# EasyEDA Pro project 3-PCB设计-勿外传.epro

# Schematic SCH1
Create Date: 2025-03-10; Page Name: P1; Project Name: AI虚拟女友; Schematic Name: SCH1; Update Date: 2025-03-10; Company: 嘉立创EDA; Page Size: A4; Version: V1.0
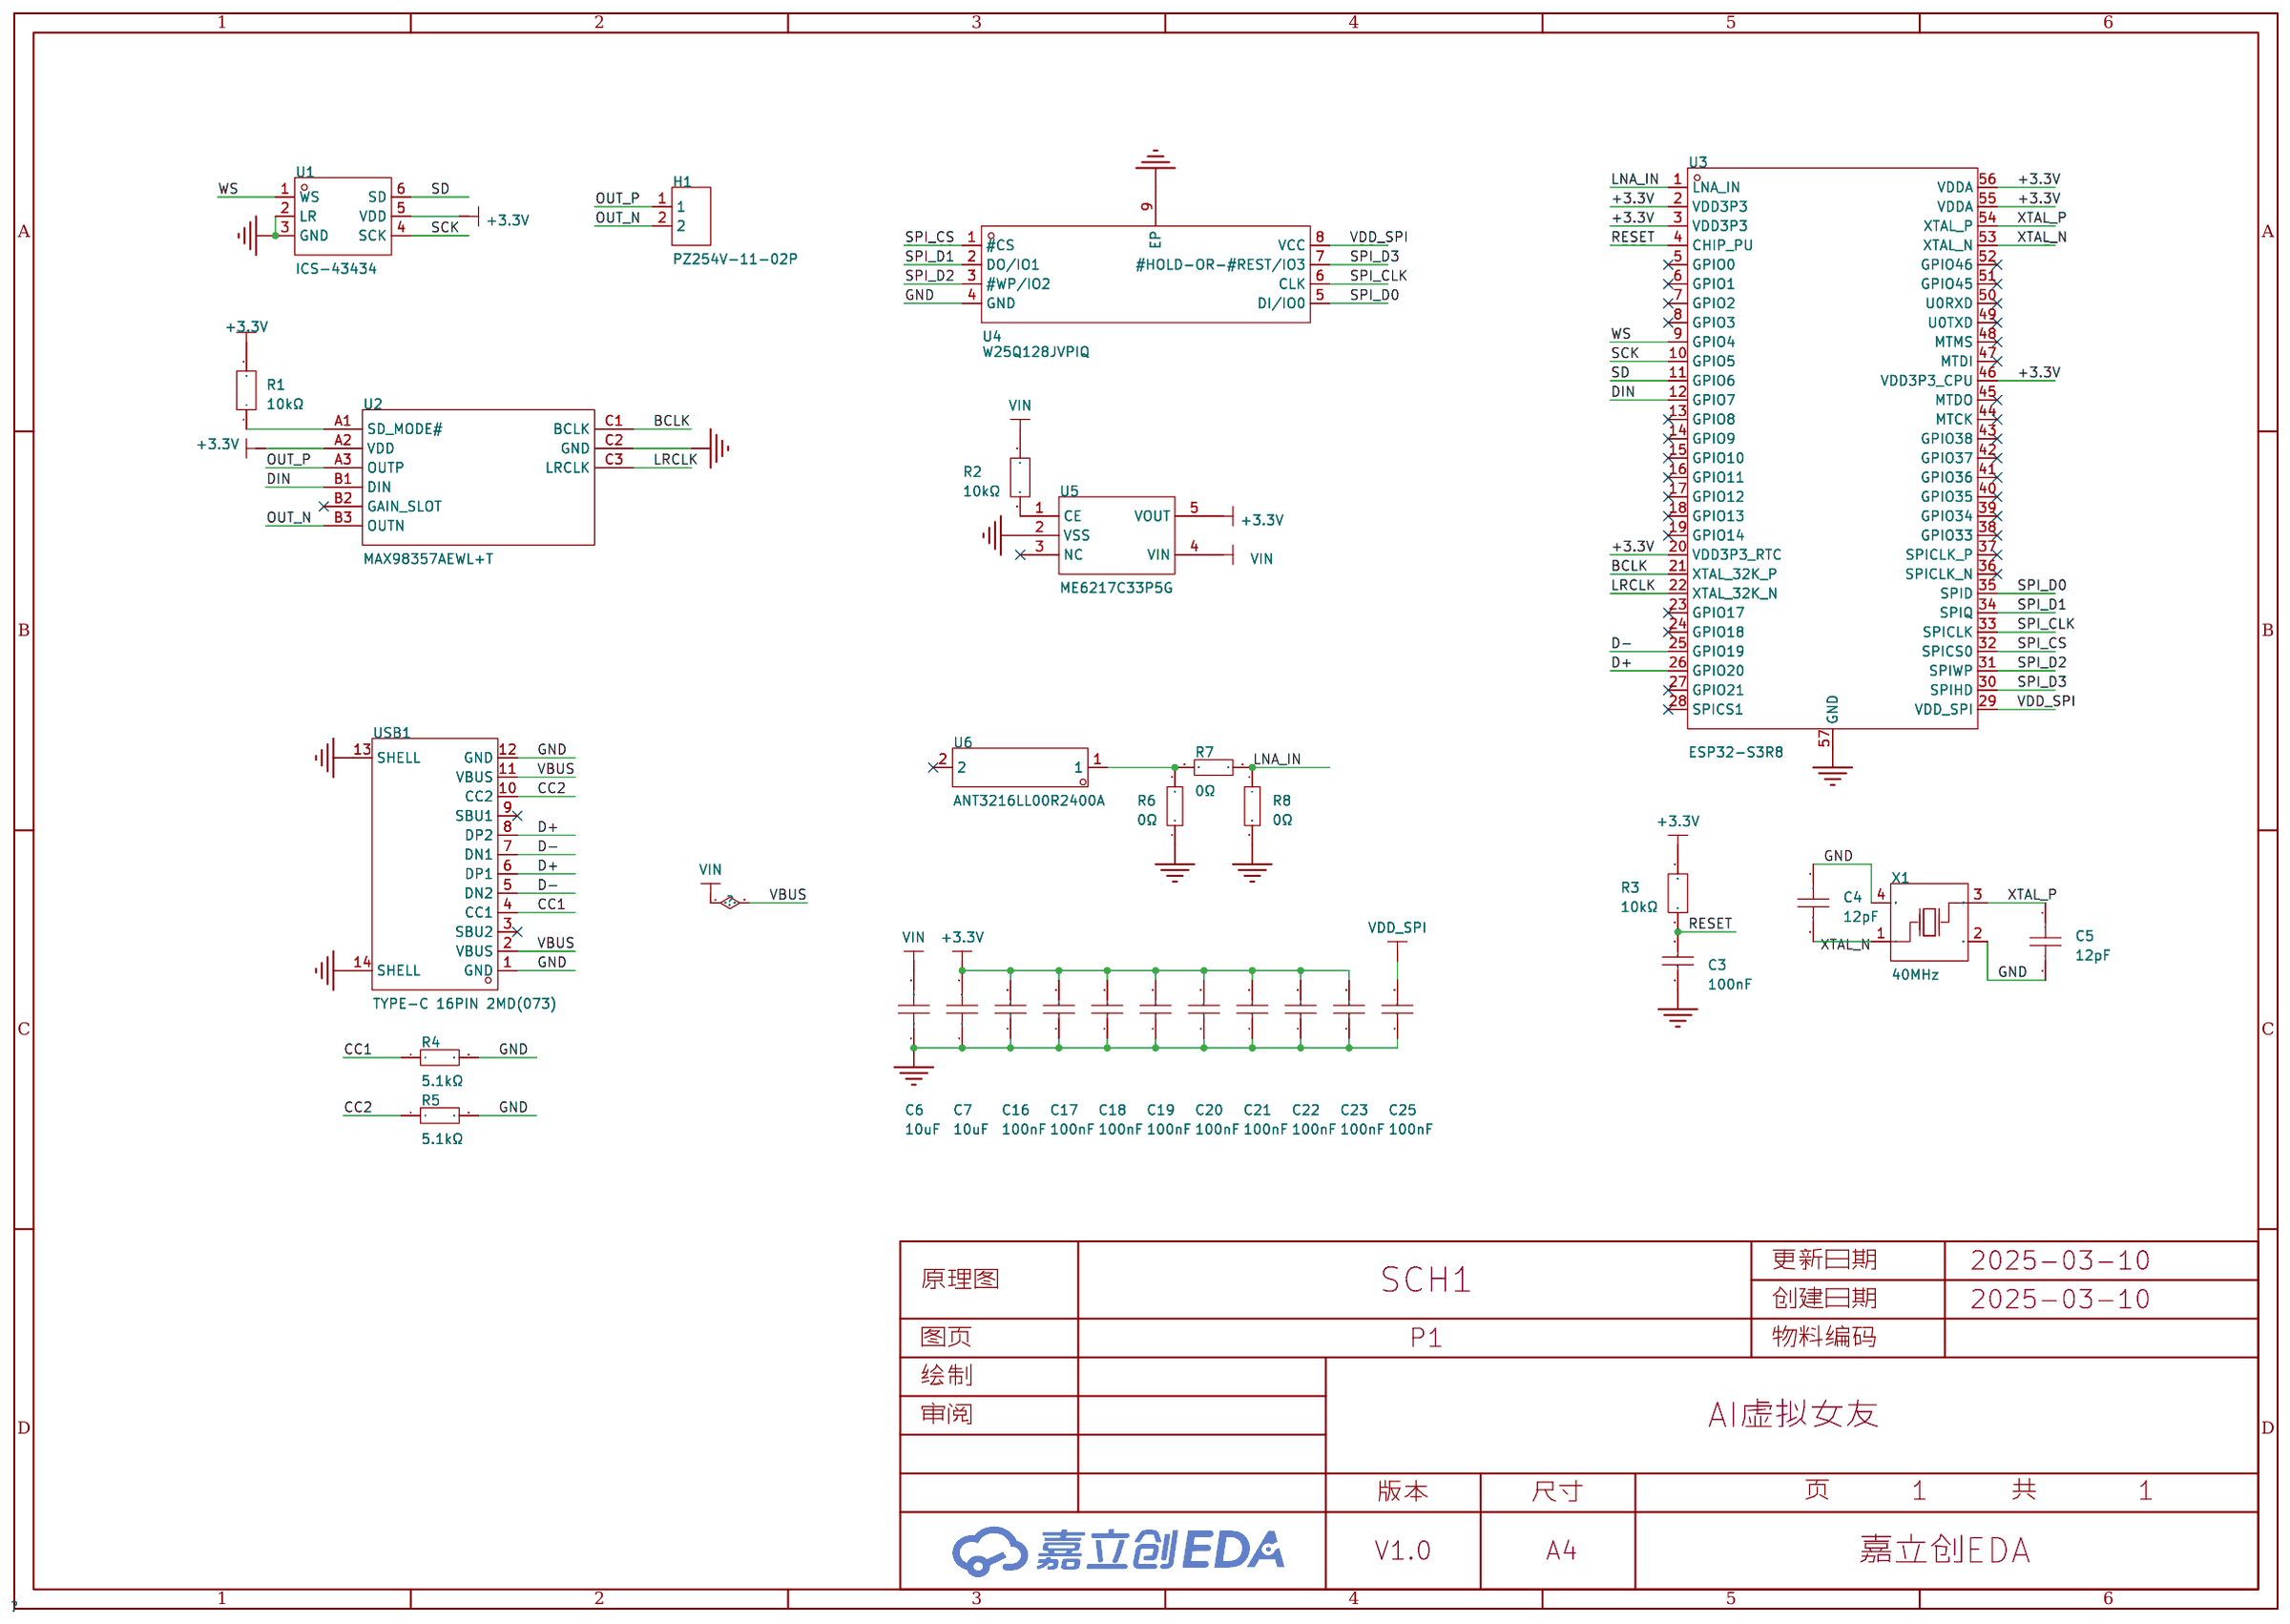
[diagram p0: schematic sheet]

## Parts
C3  100nF  [C0201]
C4  12pF  [C0201]
C5  12pF  [C0201]
C6  10uF  [C0603]
C7  10uF  [C0603]
C16  100nF  [C0201]
C17  100nF  [C0201]
C18  100nF  [C0201]
C19  100nF  [C0201]
C20  100nF  [C0201]
C21  100nF  [C0201]
C22  100nF  [C0201]
C23  100nF  [C0201]
C25  100nF  [C0201]
H1  PZ254V-11-02P  [HDR-TH_2P-P2.54-V-M]
R1  10kΩ  [R0201]
R2  10kΩ  [R0201]
R3  10kΩ  [R0201]
R4  5.1kΩ  [R0201]
R5  5.1kΩ  [R0201]
R6  0Ω  [R0402]
R7  0Ω  [R0402]
R8  0Ω  [R0402]
U1  ICS-43434  [MIC-SMD_6P-L3.5-W2.7-P0.90-BL]
U2  MAX98357AEWL+T  [WLP-9_L1.4-W1.3-P0.40-R3-C3-BR]
U3  ESP32-S3R8  [QFN-56_L7.0-W7.0-P0.40-TL-EP4.0]
U4  W25Q128JVPIQ  [WSON-8_L6.0-W5.0-P1.27-BL-EP]
U5  ME6217C33P5G  [SOT-89-5_L4.5-W2.5-P1.50-LS4.5-BR]
U6  ANT3216LL00R2400A  [ANT-SMD_L3.2-W1.6]
USB1  TYPE-C 16PIN 2MD(073)  [USB-C-SMD_TYPE-C-6PIN-2MD-073]
X1  40MHz  [CRYSTAL-SMD_4P-L3.2-W2.5-BL]

## Library data of the parts
C3 C16-C23 C25 = GRM033R61E104KE14D: 容值:100nF;精度:±10%;额定电压:25V;材质(温度系数):X5R;; LCSC Part Name: 100nF ±10% 25V; Supplier Part: C76939; Manufacturer: muRata(村田); Supplier Footprint: 0201; JLCPCB Part Class: 扩展库; Datasheet: https://atta.szlcsc.com/upload/public/pdf/source/20180307/C76939_15204091018551407727.pdf; Supplier: LCSC; Tolerance: ±10%; Voltage Rated: 25V; Temperature Coefficient: X5R
C4 C5 = CC0201JRNPO9BN120: 容值:12pF;精度:±5%;额定电压:50V;材质(温度系数):NP0;; LCSC Part Name: 12pF ±5% 50V; Supplier Part: C277478; Manufacturer: YAGEO(国巨); Supplier Footprint: 0201; JLCPCB Part Class: 扩展库; Datasheet: https://atta.szlcsc.com/upload/public/pdf/source/20181008/C309499_21CC21451B82C39E3D92150FD6B30293.pdf; Supplier: LCSC; Tolerance: ±5%; Voltage Rated: 50V; Temperature Coefficient: NP0
C6 C7 = CGA0603X5R106K100JT: 容值:10uF;精度:±10%;额定电压:10V;材质(温度系数):X5R;; LCSC Part Name: 10uF ±10% 10V; Supplier Part: C6119842; Manufacturer: HRE(芯声); Supplier Footprint: 0603; JLCPCB Part Class: 扩展库; Supplier: LCSC; Tolerance: ±10%; Voltage Rated: 10V; Temperature Coefficient: X5R
H1 = PZ254V-11-02P: 插针结构:1x2P;间距:2.54mm;行距:-;圆针/方针:方针;安装方式:直插;排数:单排;总PIN位数:2P;额定电流:-;额定电压:-;配合针长度:6mm;塑高:2.5mm;端接针长度:3mm;触头材质:黄铜;触头镀层:-;工作温度:-40℃~+105℃;颜色:黑色;; LCSC Part Name: 1x2P 间距:2.54mm 方针 直插; Supplier Part: C492401; Manufacturer: XFCN(兴飞); Supplier Footprint: 插件,P=2.54mm; JLCPCB Part Class: 扩展库; Datasheet: https://atta.szlcsc.com/upload/public/pdf/source/20200309/C492401_A812433581A9B211A7FFA413ADDFF0E5.pdf; Supplier: LCSC; Pin Structure: 1x2P; Pitch: 2.54mm; Circluar Pins/Square Pins: 方针; Mounting Type: 直插; Number of Rows: 单排; Number of Pins: 2P; Length of Mating Pin: 6mm; Insulation Height: 2.5mm; Length of End Connection Pin: 3mm; Contact Material: 黄铜; Operating Temperature: -40℃~+105℃; Color: 黑色
R1-R3 = 0201WMF1002TEE: 电阻类型:厚膜电阻;阻值:10kΩ;精度:±1%;功率:50mW;最大工作电压:25V;温度系数:±200ppm/℃;; LCSC Part Name: 10kΩ ±1% 50mW 厚膜电阻; Supplier Part: C473048; Manufacturer: UNI-ROYAL(厚声); Supplier Footprint: 0201; JLCPCB Part Class: 扩展库; Datasheet: https://atta.szlcsc.com/upload/public/pdf/source/20200306/C422600_1E6D84923E4A46A82E41ADD87F860B5C.pdf; Supplier: LCSC; Type: 厚膜电阻; Tolerance: ±1%; Power(Watts): 50mW; Overload Voltage (Max): 25V; Temperature Coefficient: ±200ppm/℃; Operating Temperature Range: -55℃~+155℃
R4 R5 = RC0201FR-075K1L: 电阻类型:厚膜电阻;阻值:5.1kΩ;精度:±1%;功率:50mW;最大工作电压:25V;温度系数:±200ppm/℃;; LCSC Part Name: 厚膜电阻 5.1kΩ ±1% 50mW; Supplier Part: C274341; Manufacturer: YAGEO(国巨); Supplier Footprint: 0201; JLCPCB Part Class: 扩展库; Datasheet: https://atta.szlcsc.com/upload/public/pdf/source/20180821/C275644_0D56F95EFF785E7D9A1FEF436B37DA78.pdf; Supplier: LCSC; Type: 厚膜电阻; Tolerance: ±1%; Power(Watts): 50mW; Overload Voltage (Max): 25V; Temperature Coefficient: ±200ppm/℃; Operating Temperature Range: -55℃~+125℃
R6-R8 = 0402WGF0000TCE: 电阻类型:厚膜电阻;阻值:0Ω;精度:±1%;功率:62.5mW;最大工作电压:50V;温度系数:±800ppm/℃;; LCSC Part Name: 0Ω ±1% 62.5mW 厚膜电阻; Supplier Part: C17168; Manufacturer: UNI-ROYAL(厚声); Supplier Footprint: 0402; JLCPCB Part Class: 基础库; Datasheet: https://atta.szlcsc.com/upload/public/pdf/source/20200306/C422600_1E6D84923E4A46A82E41ADD87F860B5C.pdf; Supplier: LCSC; Type: 厚膜电阻; Tolerance: ±1%; Power(Watts): 62.5mW; Overload Voltage (Max): 50V; Temperature Coefficient: ±800ppm/℃; Operating Temperature Range: -55℃~+155℃
U1 = ICS-43434_C5656610: 指向性:全指向;信噪比:64dB;灵敏度:-;; Supplier Part: C5656610; Manufacturer: TDK InvenSense(应美盛); JLCPCB Part Class: 扩展库; Datasheet: https://atta.szlcsc.com/upload/public/pdf/source/231023/DS-000069-ICS-43434-v1.2-8194c7772d771e21a553109502704f97.pdf; Supplier: LCSC; Direction: 全指向; Supply Voltage: 1.65V~3.63V; Current Consumption: 550uA; SNR(Signal to Noise Ratio): 64dB
U2 = MAX98357AEWL+T: 功放类型:-;扬声器通道数:单声道;输出功率:3.2Wx2@4Ω;; LCSC Part Name: 微型、低成本、PCM 类 D 级放大器具有 AB 级性能; Supplier Part: C2682619; Manufacturer: ADI(亚德诺)/MAXIM(美信); Supplier Footprint: BGA-9(1.3x1.3); JLCPCB Part Class: 扩展库; Datasheet: https://atta.szlcsc.com/upload/public/pdf/source/20210106/C2682619_15CCD654F2C559A2FC5FDCA8EA0D4E6D.pdf; Supplier: LCSC; Speaker Channels: 单声道; Output Power: 3.2Wx2@4Ω; Supply Voltage: 2.5V~5.5V; Operating Temperature: -40℃~+85℃
U3 = ESP32-S3R8: 频率范围:2.412GHz~2.484GHz;接口:I2C,I2S,SPI,UART,USB;应用领域:蓝牙；WiFi;数据速率:150Mbps;灵敏度:-98.4dBm;; Supplier Part: C2913194; Manufacturer: ESPRESSIF(乐鑫); Supplier Footprint: QFN-56(7x7); JLCPCB Part Class: 扩展库; Datasheet: https://atta.szlcsc.com/upload/public/pdf/source/20231007/CDA236FFCB3F25B7D5220D2CA9867287.pdf; Supplier: LCSC; Frequency Range: 2.412GHz~2.484GHz; Interface: I2C,I2S,SPI,UART,USB; Operating Voltage: 3.3V; Applications: 蓝牙；WiFi; Output Power: 21dBm; Data Rate: 150Mbps; Sensitivity: -98.4dBm; Operating Temperature: -40℃~+85℃
U4 = W25Q128JVPIQ_C190862: 存储容量:128Mbit;; Supplier Part: C190862; Manufacturer: WINBOND(华邦); Supplier Footprint: WSON-8-EP(5x6); JLCPCB Part Class: 扩展库; Datasheet: https://atta.szlcsc.com/upload/public/pdf/source/20190705/C401662_06B6D416F67ED315879B366F63A3F7C9.pdf; Supplier: LCSC; Memory Size: 128Mbit
U5 = ME6217C33P5G: 输出类型:固定;最大输入电压:6.5V;输出电压:3.3V;最大输出电流:800mA;电源纹波抑制比(PSRR):65dB@(1kHz);输出极性:正极;; LCSC Part Name: 输入6.5V 输出3.3V 800mA; Supplier Part: C81592; Manufacturer: MICRONE(南京微盟); Supplier Footprint: SOT-89-5; JLCPCB Part Class: 扩展库; Datasheet: https://atta.szlcsc.com/upload/public/pdf/source/20170919/C81592_1505787400735977273.pdf; Supplier: LCSC; Output Type: 固定; Maximum Input Voltage: 6.5V; Output Voltage: 3.3V; MAX Output Current: 800mA; Power Supply Rejection Ratio (PSRR): 65dB@(1kHz); Dropout Voltage: 180mV@(300mA); Output Polarity: 正极; Number of Outputs: 1
U6 = ANT3216LL00R2400A: 天线类型:芯片天线;中心频点:2.45GHz;带宽:160MHz;峰值增益:5.05dBi;极化方式:线性;功率容量:1W;驻波比:-;; LCSC Part Name: 无线组件陶瓷芯片天线; Supplier Part: C293767; Manufacturer: YAGEO(国巨); Supplier Footprint: 1206; JLCPCB Part Class: 扩展库; Datasheet: https://atta.szlcsc.com/upload/public/pdf/source/20181012/C293767_CDE82A2F74DC82A94DB708CB53B68F23.pdf; Supplier: LCSC; Antenna Type: 芯片天线; Central Frequency: 2.45GHz; Bandwidth: 160MHz; Peak Gain: 5.05dBi; Polarization Type: 线性; Impedance: 50Ω; Power capacity: 1W; Operating Temperature: -40℃~+105℃
USB1 = TYPE-C 16PIN 2MD(073): 连接器类型:Type-C;标准:USB 3.1;公母:母;安装方式:卧贴;触点数量:16P;端口数量:1;额定电流 - 电源:5A;工作温度范围:-25℃~+85℃;; LCSC Part Name: Type-C 母 卧贴; Supplier Part: C2765186; Manufacturer: SHOU HAN(首韩); Supplier Footprint: SMD; JLCPCB Part Class: 扩展库; Datasheet: https://atta.szlcsc.com/upload/public/pdf/source/20211123/39B17C16241EAC15C5E277BDA434118E.pdf; Supplier: LCSC; Connector Type: Type-C; Standard: USB 3.1; Gender: 母; Mounting Style: 卧贴; Number of Contacts: 16P; Number of Ports: 1; Current Rating - Power (Max): 5A; Operating Temperature Range: -25℃~+85℃; Rated Voltage (Max): 5V; Connect-Disconnect Life: 5千次; Core Colour: 黑色
X1 = S3240000121040: 晶振类型:贴片晶振;频率:40MHz;常温频差:±10ppm;外接负载电容:12pF;; LCSC Part Name: 40MHz ±10ppm 12pF; Supplier Part: C426989; Manufacturer: JGHC(晶光华); Supplier Footprint: SMD3225-4P; JLCPCB Part Class: 扩展库; Datasheet: https://atta.szlcsc.com/upload/public/pdf/source/20191012/C431172_99BCDFC5E39E114929AE7F9C9DED2B9F.pdf; Supplier: LCSC; Crystal Type: 贴片晶振; Normal temperature Frequency Tolerance: ±10ppm; External load capacitor: 12pF; Equivalent Series Resistance (ESR): 40Ω; Operating Temperature: -40℃~+85℃

## Nets
+3.3V: C7.2 C16.2 C17.2 C18.2 C19.2 C20.2 C21.2 C22.2 C23.2 R1.2 R3.1 U1.5(VDD) U2.A2(VDD) U3.2(VDD3P3) U3.3(VDD3P3) U3.20(VDD3P3_RTC) U3.46(VDD3P3_CPU) U3.55(VDDA) U3.56(VDDA) U5.5(VOUT)
GND: C3.1 C4.1 C5.2 C6.1 C7.1 C16.1 C17.1 C18.1 C19.1 C20.1 C21.1 C22.1 C23.1 C25.1 R4.2 R5.2 R6.1 R8.2 U1.2(LR) U1.3(GND) U2.C2(GND) U3.57(GND) U4.4(GND) U4.9(EP) U5.2(VSS) USB1.1(GND) USB1.12(GND) USB1.13(SHELL) USB1.14(SHELL) X1.2(GND) X1.4(GND)
VDD_SPI: C25.2 U3.29(VDD_SPI) U4.8(VCC)
VIN: C6.2 R2.1 U5.4(VIN) USB1.2(VBUS) USB1.11(VBUS)
BCLK: U2.C1(BCLK) U3.21(XTAL_32K_P)
CC1: R4.1 USB1.4(CC1)
CC2: R5.1 USB1.10(CC2)
D+: U3.26(GPIO20) USB1.6(DP1) USB1.8(DP2)
D-: U3.25(GPIO19) USB1.5(DN2) USB1.7(DN1)
DIN: U2.B1(DIN) U3.12(GPIO7)
LNA_IN: R7.1 R8.1 U3.1(LNA_IN)
LRCLK: U2.C3(LRCLK) U3.22(XTAL_32K_N)
OUT_N: H1.2 U2.B3(OUTN)
OUT_P: H1.1 U2.A3(OUTP)
RESET: C3.2 R3.2 U3.4(CHIP_PU)
SCK: U1.4(SCK) U3.10(GPIO5)
SD: U1.6(SD) U3.11(GPIO6)
SPI_CLK: U3.33(SPICLK) U4.6(CLK)
SPI_CS: U3.32(SPICS0) U4.1(#CS)
SPI_D0: U3.35(SPID) U4.5(DI/IO0)
SPI_D1: U3.34(SPIQ) U4.2(DO/IO1)
SPI_D2: U3.31(SPIWP) U4.3(#WP/IO2)
SPI_D3: U3.30(SPIHD) U4.7(#HOLD-OR-#REST/IO3)
WS: U1.1(WS) U3.9(GPIO4)
XTAL_N: C4.2 U3.53(XTAL_N) X1.1(OSC1)
XTAL_P: C5.1 U3.54(XTAL_P) X1.3(OSC2)
$R1_1: R1.1 U2.A1(SD_MODE#)
$R2_2: R2.2 U5.1(CE)
$R6_2: R6.2 R7.2 U6.1

Not connected (* = marked no-connect by the designer): U2 B2(GAIN_SLOT)*; U3 5(GPIO0)* 6(GPIO1)* 7(GPIO2)* 8(GPIO3)* 13(GPIO8)* 14(GPIO9)* 15(GPIO10)* 16(GPIO11)* 17(GPIO12)* 18(GPIO13)* 19(GPIO14)* 23(GPIO17)* 24(GPIO18)* 27(GPIO21)* 28(SPICS1)* 36(SPICLK_N)* 37(SPICLK_P)* 38(GPIO33)* 39(GPIO34)* 40(GPIO35)* 41(GPIO36)* 42(GPIO37)* 43(GPIO38)* 44(MTCK)* 45(MTDO)* 47(MTDI)* 48(MTMS)* 49(U0TXD)* 50(U0RXD)* 51(GPIO45)* 52(GPIO46)*; U5 3(NC)*; U6 2*; USB1 3(SBU2)* 9(SBU1)*

# Board PCB1_1
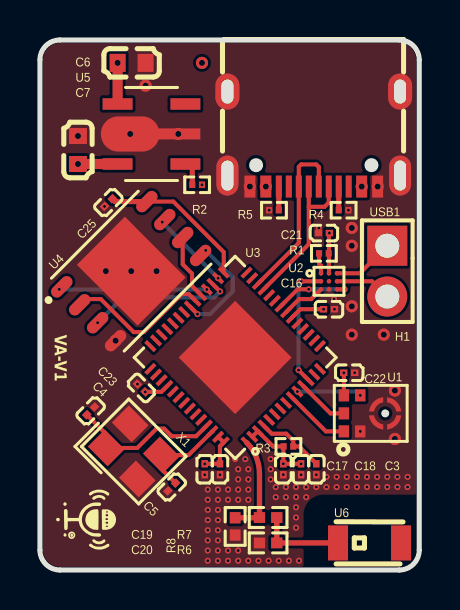
[diagram p1: board, top side]
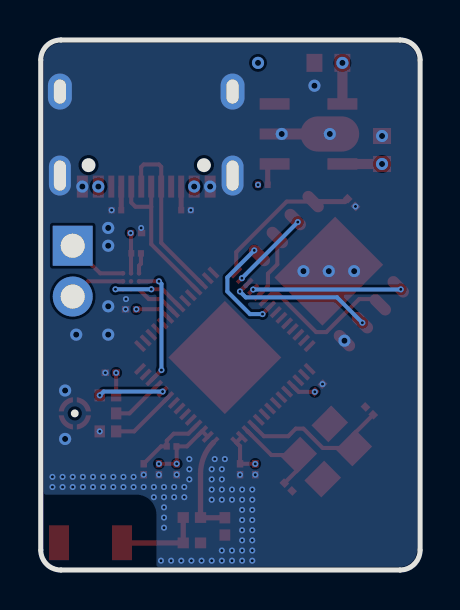
[diagram p2: board, bottom side, seen from below]

Outline 19 x 26.5 mm; copper layers: Top Layer, GND, VCC, Bottom Layer. Coordinates in mm from the lower left corner of the outline.
Outline path: 0,25.5 0,1 arc(0.29,0.29) 1,0 18,0 arc(18.71,0.29) 19,1 19,25.5 arc(18.71,26.21) 18,26.5 1,26.5 arc(0.29,26.21) 0,25.5
Stack: Top Layer 0.035mm 外层铜厚1oz / Dielectric1 0.2104mm 7628 RC49% 8.6mil / GND 0.0152mm 内层铜厚 / Dielectric2 1.065mm 1.1mm H/HOZ 含铜 / VCC 0.0152mm 内层铜厚 / Dielectric3 0.2104mm 7628 RC49% 8.6mil / Bottom Layer 0.035mm 外层铜厚1oz

## Design rules (mm)
template: 自定义配置
spacing 5.5mil间距 (default): track to track 0.127, other pairs 0.127 to 0.127
track width copperThickness1oz (default): min 0.127, default 0.254, max 2.54
track width copperThickness2oz: min 0.203, default 0.254, max 2.54
differential pair differentialPair (default): width min 0.127, default 0.254, max 2.54; gap min 0.152, default 0.152
via viaSize (default): diameter min 0.249, default 0.61, max 10; hole min 0.15, default 0.305, max 6.299

## Placement (name value [footprint] x y rotation side)
C3  100nF  [C0201]  13.84 5.04 90 top
C4  12pF  [C0201]  2.54 7.96 225 top
C5  12pF  [C0201]  6.6 4.15 225 top
C6  10uF  [C0603]  4.59 25.36 180 top
C7  10uF  [C0603]  1.91 21 270 top
C16  100nF  [C0201]  14.48 13.04 180 top
C17  100nF  [C0201]  12.19 5.04 90 top
C18  100nF  [C0201]  13.08 5.04 90 top
C19  100nF  [C0201]  9.02 5.04 90 top
C20  100nF  [C0201]  8.25 5.04 90 top
C21  100nF  [C0201]  14.22 16.85 0 top
C22  100nF  [C0201]  15.49 9.86 180 top
C23  100nF  [C0201]  5.08 9.1 315 top
C25  100nF  [C0201]  3.43 18.37 45 top
H1  PZ254V-11-02P  [HDR-TH_2P-P2.54-V-M]  17.4 14.94 270 top
R1  10kΩ  [R0201]  14.22 15.83 0 top
R2  10kΩ  [R0201]  7.87 19.26 180 top
R3  10kΩ  [R0201]  12.45 6.18 0 top
R4  5.1kΩ  [R0201]  15.21 17.99 0 top
R5  5.1kΩ  [R0201]  11.72 17.99 180 top
R6  0Ω  [R0402]  11.43 1.35 0 top
R7  0Ω  [R0402]  11.43 2.62 0 top
R8  0Ω  [R0402]  9.78 2.18 270 top
U1  ICS-43434  [MIC-SMD_6P-L3.5-W2.7-P0.90-BL]  16.51 7.83 0 top
U2  MAX98357AEWL+T  [WLP-9_L1.4-W1.3-P0.40-R3-C3-BR]  14.48 14.44 180 top
U3  ESP32-S3R8  [QFN-56_L7.0-W7.0-P0.40-TL-EP4.0]  9.78 10.62 135 top
U4  W25Q128JVPIQ  [WSON-8_L6.0-W5.0-P1.27-BL-EP]  4.57 14.94 315 top
U5  ME6217C33P5G  [SOT-89-5_L4.5-W2.5-P1.50-LS4.5-BR]  5.59 21.8 0 top
U6  ANT3216LL00R2400A  [ANT-SMD_L3.2-W1.6]  16.51 1.35 0 top
USB1  TYPE-C 16PIN 2MD(073)  [USB-C-SMD_TYPE-C-6PIN-2MD-073]  13.72 21.55 180 top
X1  40MHz  [CRYSTAL-SMD_4P-L3.2-W2.5-BL]  4.7 5.93 315 top

## Footprints (pads in the part's own frame, mm; a bottom-side part is the same pattern mirrored in y, then rotated)
ANT-SMD_L3.2-W1.6
  rect 1x1.75 smd: 1(-1.578,0) 2(1.578,0)
C0201
  rect 0.368x0.324 smd: 1(-0.275,0) 2(0.275,0)
C0603
  rect 0.8x0.9 smd: 1(-0.7,0) 2(0.7,0)
CRYSTAL-SMD_4P-L3.2-W2.5-BL
  rect 1.4x1.2 smd: 1(-1.1,-0.85) 2(1.1,-0.85) 3(1.1,0.85) 4(-1.1,0.85)
HDR-TH_2P-P2.54-V-M
  rect 2x2 hole 1.2: 1(-1.27,0)
  round 2 hole 1.2: 2(1.27,0)
MIC-SMD_6P-L3.5-W2.7-P0.90-BL
  rect 0.52x0.6 smd: 1(-1.286,-0.9) 2(-0.465,-0.9) 4(-0.465,0.9) 5(-1.286,0.9) 6(-1.286,0)
  custom 0.709x0.71 smd: 3(0.276,-0.452) 3(0.329,0.505) 3(1.234,-0.505) 3(1.286,0.452)
QFN-56_L7.0-W7.0-P0.40-TL-EP4.0
  rect 0.665x0.2 smd: 1(-3.408,2.6) 2(-3.407,2.2) 3(-3.408,1.8) 4(-3.408,1.4) 5(-3.408,1) 6(-3.407,0.6) 7(-3.408,0.2) 8(-3.408,-0.2) 9(-3.407,-0.6) 10(-3.408,-1) 11(-3.408,-1.4) 12(-3.408,-1.8) 13(-3.407,-2.2) 14(-3.408,-2.6) 29(3.408,-2.6) 30(3.407,-2.2) 31(3.408,-1.8) 32(3.408,-1.4) 33(3.408,-1) 34(3.407,-0.6) 35(3.408,-0.2) 36(3.408,0.2) 37(3.407,0.6) 38(3.408,1) 39(3.408,1.4) 40(3.408,1.8) 41(3.407,2.2) 42(3.408,2.6)
  rect 0.2x0.665 smd: 15(-2.6,-3.408) 16(-2.2,-3.407) 17(-1.8,-3.408) 18(-1.4,-3.408) 19(-1,-3.408) 20(-0.6,-3.407) 21(-0.2,-3.408) 22(0.2,-3.408) 23(0.6,-3.407) 24(1,-3.408) 25(1.4,-3.408) 26(1.8,-3.408) 27(2.2,-3.407) 28(2.6,-3.408) 43(2.6,3.408) 44(2.2,3.407) 45(1.8,3.408) 46(1.4,3.408) 47(1,3.408) 48(0.6,3.407) 49(0.2,3.408) 50(-0.2,3.408) 51(-0.6,3.407) 52(-1,3.408) 53(-1.4,3.408) 54(-1.8,3.408) 55(-2.2,3.407) 56(-2.6,3.408)
  rect 4x4 smd: 57(0,0)
R0201
  rect 0.303x0.324 smd: 1(-0.241,0) 2(0.241,0)
R0402
  rect 0.566x0.54 smd: 1(-0.433,0) 2(0.433,0)
SOT-89-5_L4.5-W2.5-P1.50-LS4.5-BR
  rect 1.5x0.574 smd: 1(1.698,-1.5) 3(1.698,1.5) 4(-1.698,1.5) 5(-1.698,-1.5)
  oval 2.94x1.76 smd: 2(-1.067,0)
  rect 2.209x0.552 smd: 2(1.343,0)
USB-C-SMD_TYPE-C-6PIN-2MD-073
  rect 0.55x1.1 smd: 1(-3.2,2.375) 2(-2.4,2.375) 11(2.4,2.375) 12(3.2,2.375)
  rect 0.3x1.1 smd: 3(-1.75,2.375) 4(-1.25,2.375) 5(-0.75,2.375) 6(-0.25,2.375) 7(0.25,2.375) 8(0.75,2.375) 9(1.25,2.375) 10(1.75,2.375)
  oval 1.1x2 hole 0.6x1.5: 13(-4.325,1.825) 14(4.325,1.825)
  oval 1.2x1.8 hole 0.6x1.2: 13(-4.325,-2.375) 14(4.325,-2.375)
WLP-9_L1.4-W1.3-P0.40-R3-C3-BR
  round 0.23 smd: A1(0.4,-0.4) A2(0,-0.4) A3(-0.4,-0.4) B1(0.4,0) B2(0,0) B3(-0.4,0) C1(0.4,0.4) C2(0,0.4) C3(-0.4,0.4)
WSON-8_L6.0-W5.0-P1.27-BL-EP
  oval 0.581x1.276 smd: 1(-1.905,-3.013) 2(-0.635,-3.013) 3(0.635,-3.013) 4(1.905,-3.013) 5(1.905,3.013) 6(0.635,3.013) 7(-0.635,3.013) 8(-1.905,3.013)
  rect 4.3x3.4 smd: 9(0,0)

## Nets
As in the schematic.

Pads without a net: U2 B2; U3 5 6 7 8 13 14 15 16 17 18 19 23 24 27 28 36 37 38 39 40 41 42 43 44 45 47 48 49 50 51 52; U5 3; U6 2; USB1 3 9

## Via types
v1: diameter 0.305, hole 0.152, Top Layer to Bottom Layer, 107 vias
v2: diameter 0.61, hole 0.305, Top Layer to Bottom Layer, 22 vias

## Routing (per net, layer and track width the routed paths; a pad name or vN(x,y) marks a point on that pad's centre or on a via; arc(x,y) is an arc through that point)
+3.3V: length 55.9
  Top Layer w0.203: C22.2 v1(15.22,9.86) U1.5 ; C16.2 13.04,13.04 U3.20 ; 10.63,6.66 U3.3 11.68,6.18 R3.1 12.19,6.17 v1(12.19,5.31) C18.2 ; v1(14.5,16.85) 14.48,16.83 U2.A2 ; C20.2 C19.2 9.02,6.19 9.21,6.38 8.92,6.66 ; v1(5.27,8.91) 6.08,8.91 U3.46
  Top Layer w0.508: v2(1.91,20.3) U5.5
  VCC w0.264: v2(1.91,20.3) 5.44,20.3 11.68,14.06 ; 13.77,11.97 13.97,11.77 13.97,9.8 ; 13.77,11.97 13.41,12.33 ; 13.77,11.97 8.25,6.46 ; v1(5.27,8.91) 7.72,6.46 8.25,6.46 ; 13.41,12.33 11.68,14.06 ; 13.41,12.33 13.5,12.33 v1(14.21,13.04) ; 11.68,14.06 11.71,14.06 v1(14.5,16.85) ; 13.97,9.8 13.97,6.2 v1(13.08,5.31) ; 13.97,9.8 14.03,9.86 v1(15.22,9.86) ; 8.25,6.46 v1(8.25,5.31)
GND:
  vias: v1(3.23,18.18) v1(4.89,9.3) v1(8.25,4.76) v1(8.41,4.02) v1(8.41,3.51) v1(8.41,3.01) v1(8.41,2.5) v1(8.41,1.99) v1(8.41,1.48) v1(8.41,0.97) v1(8.41,0.47) v1(8.91,4.02) v1(8.91,3.51) v1(8.91,3.01) v1(8.91,2.5) v1(8.91,1.99) v1(8.91,1.48) v1(8.91,0.97) v1(8.91,0.47) v1(9.02,4.76) v1(9.42,4.02) v1(9.42,3.51) v1(9.42,0.97) v1(9.42,0.47) v1(9.78,5.55) v1(9.93,5.04) v1(9.93,4.53) v1(9.93,4.02) v1(9.93,3.51) v1(9.93,0.97) v1(9.93,0.47) v1(10.29,5.55) v1(10.44,5.04) v1(10.44,4.53) v1(10.44,4.02) v1(10.44,3.51) v1(10.44,0.47) v1(10.95,0.47) v1(11.45,0.47) v1(11.49,17.99) v1(11.56,5.55) v1(11.56,5.04) v1(11.56,4.53) v1(11.81,4.15) v1(11.81,3.64) v1(11.96,0.47) v1(12.19,4.77) v1(12.32,4.15) v1(12.32,3.64) v1(12.47,0.47) v1(12.83,4.15) v1(12.83,3.64) v1(12.83,3.13) v1(12.83,2.62) v1(12.83,2.12) v1(12.98,0.47) v1(13.08,4.76) v1(13.33,4.15) v1(13.33,3.64) v1(13.84,4.76) v1(13.84,4.15) v1(13.97,17.1) v1(14.35,4.66) v1(14.35,4.15) v1(14.73,13.55) v1(14.75,13.04) v1(14.86,4.66) v1(14.86,4.15) v1(15.37,4.66) v1(15.37,4.15) v1(15.45,17.99) v1(15.76,9.86) v1(15.88,4.66) v1(15.88,4.15) v1(16.05,6.93) v1(16.38,4.66) v1(16.38,4.15) v1(16.89,4.66) v1(16.89,4.15) v1(17.4,4.66) v1(17.4,4.15) v1(17.91,4.66) v1(17.91,4.15) v1(18.41,4.66) v1(18.41,4.15) v2(1.91,21.7) v2(3.3,14.94) v2(3.79,11.47) v2(4.52,21.8) v2(4.57,14.94) v2(5.29,24.21) v2(5.84,14.94) v2(6.93,21.8) v2(10.52,19.17) v2(15.62,17.1) v2(15.62,16.21) v2(15.62,13.19) v2(15.62,11.77) v2(16.92,19.17) v2(17.22,11.77) v2(17.78,8.97) v2(17.78,6.55)
VDD_SPI: length 7.7
  Top Layer w0.203: 9.21,14.87 9.21,15.9 6.68,18.42 U4.8
  Top Layer w0.254: U4.8 3.77,18.42 3.62,18.57
VIN: length 26.4
  Top Layer w0.508: U5.4 v2(3.89,25.36)
  VCC w0.203: v2(8.12,25.36) 8.12,25.35 v1(8.12,19.26)
  VCC w0.508: v2(3.89,25.36) v2(8.12,25.36) 10.54,25.36 12.02,23.88 12.02,19.17 ; 12.02,19.17 v2(11.32,19.17) ; 12.02,19.17 v2(16.12,19.17)
$R1_1: length 1
  Top Layer w0.203: R1.1 13.98,15.31 14.08,15.22 U2.A1
$R2_2: length 1.4
  Top Layer w0.254: R2.2 7.63,20.3 U5.1
$R6_2: length 4.3
  Top Layer w0.264: U6.1 R6.2 R7.2
BCLK: length 2.2
  Top Layer w0.203: U2.C1 13.59,13.55 12.98,13.55 12.33,12.89
CC1: length 1.2
  Top Layer w0.254: R4.1 14.97,19.17
CC2: length 1.2
  Top Layer w0.254: USB1.10 11.97,17.99
D+: length 8.8
  Top Layer w0.203: U3.26 12.97,16.36 USB1.8 12.97,20.16 13.08,20.28 13.84,20.28 13.97,20.15 13.97,19.18 USB1.6
D-: length 8
  Top Layer w0.203: 13.47,18.16 13.47,16.29 U3.25 ; 13.47,18.16 USB1.7 ; 13.47,18.16 14.26,18.16 14.47,18.37 USB1.5
DIN: length 6.2
  Top Layer w0.203: v1(13.08,14.44) U2.B1 ; U3.12 v1(12.95,10)
  Bottom Layer w0.203: v1(13.08,14.44) 12.95,14.31 v1(12.95,10)
LNA_IN: length 5.1
  Top Layer w0.264: R8.1 10.97,2.61 arc(10.98,2.61) R7.1 11,4.81 arc(10.83,5.66) 10.35,6.38
LRCLK: length 4
  Top Layer w0.203: v1(13.46,14.04) 12.91,14.04 12.05,13.18 ; U2.C3 v1(15.26,14.04)
  Bottom Layer w0.203: 13.46,14.05 13.48,14.04 v1(15.26,14.04)
OUT_N: length 2.8
  Top Layer w0.203: H1.2 16.64,14.44 U2.B3
OUT_P: length 3.1
  Top Layer w0.203: U2.A3 16.02,14.84 H1.1
RESET: length 3.6
  Top Layer w0.203: U3.4 11.61,6.82 12.34,6.82 12.69,6.47 R3.2 12.97,6.18 C3.2
SCK: length 3.2
  Bottom Layer w0.203: v1(12.9,8.92) 15.85,8.92 v1(16.05,8.73)
SD: length 2.6
  Top Layer w0.203: U3.11 14.55,7.83 U1.6
SPI_CLK: length 3.3
  Top Layer w0.203: U4.6 7.15,15.28 7.62,14.82 7.62,14.2 U3.33
SPI_CS: length 7.4
  Bottom Layer w0.203: v1(0.97,14.03) 0.98,14.02 v1(8.36,14.02)
SPI_D0: length 5.4
  Top Layer w0.203: 7.51,13.18 v1(7.89,12.8)
  Bottom Layer w0.203: v1(7.89,12.8) 8.52,12.8 9.65,13.93 9.65,14.63 v1(8.3,15.98)
SPI_D1: length 7.5
  Top Layer w0.203: U3.34 7.45,13.8 7.11,13.8 5.21,11.9 4.7,11.9 3.05,13.55 2.28,13.55 U4.2
SPI_D2: length 7.3
  Top Layer w0.203: U3.31 v1(9.02,13.93)
  Bottom Layer w0.203: v1(2.89,12.36) 4.16,13.63 8.73,13.63 v1(9.02,13.93)
SPI_D3: length 4
  Bottom Layer w0.203: v1(8.92,14.59) 6.13,17.39 v1(6.13,17.4)
WS: length 3.3
  Top Layer w0.203: U3.9 14.32,6.93 U1.1
XTAL_N: length 7.9
  Top Layer w0.203: 2.35,7.76 3.32,6.79 3.32,6.1 4.88,6.1 5.84,7.07 6.22,7.07 6.6,6.69 7.82,6.69 U3.53
XTAL_P: length 4.8
  Top Layer w0.203: 8.64,6.92 U3.54 7.45,5.75 6.08,5.75 6.08,5.06 6.8,4.34

## Copper pours and planes (outline as drawn; the poured copper is in the pictures)
GND on Top Layer: -2.29,28.15 22.86,28.15 22.86,-2.58 -2.29,-2.58
GND on Bottom Layer: -1.07,27.27 20.95,27.27 20.95,-0.42 -1.07,-0.42
GND on GND: -1.78,27.77 22.1,27.77 22.1,-2.07 -1.78,-2.07
GND on VCC: -1.65,27.52 21.34,27.52 21.34,-1.06 -1.65,-1.06

## Text on the board
Document Layer: 层压结果为JLC04161H-3313A
Top Silkscreen Layer: VA-V1
